# Altium project Additionneur.PrjPcb
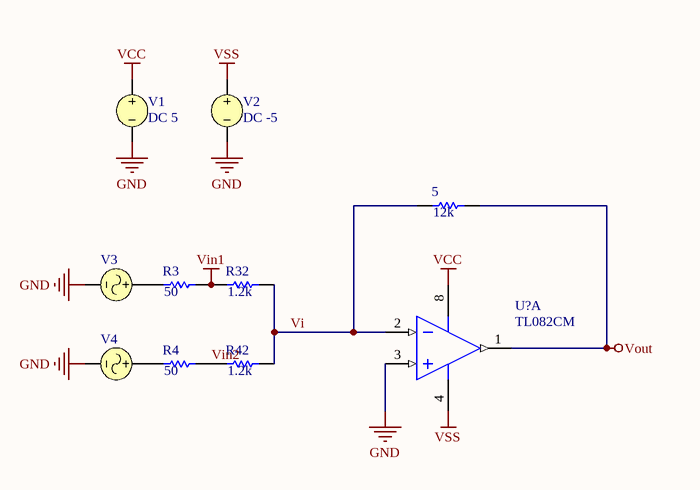
[diagram p0: additioneur.SchDoc]
1 sheet, 10 parts. Net scope: global (net labels, ports and power ports of the same name join across sheets).

## Sheet additioneur.SchDoc
size A4; SheetNumber: 1; SheetTotal: 1; SPICEModelCacheCUKPYHAH: <root> / <DocumentId>CUKPYHAH</DocumentId> / <CacheFrame Number="0"> / <Model Name="lf353" Kind="CKT"> / <Text>*////////////////////////////////////////////////////////// / *LF353 Wide Bandwidth Dual JFET-Input OP-AMP MACRO-MODEL / *////////////////////////////////////////////////////////// / * / * connections:    non-inverting input / *                 |   inverting input / *                 |   |   positive power supply / *                 |   |   |   negative power supply / *                 |   |   |   |   output / *                 |   |   |   |   | / *                 |   |   |   |   | / .SUBCKT LF353     1   2  99  50  28 / * / * PINOUT ORDER +IN -IN V+ V- OUT / * / * / *Features: / *Low supply current =                1.8mA / *Wide bandwidth =                     4MHz / *High slew rate =                   13V/uS / *Low offset voltage =                 10mV / * / *NOTE: Model is for single device only and simulated / *      supply current is 1/2 of total device current. / * / ****************INPUT STAGE************** / * / IOS 2 1 25P / *^Input offset current / R1 1 3 1E12 / R2 3 2 1E12 / I1 99 4 100U / J1 5 2 4 JX / J2 6 7 4 JX / R3 5 50 20K / R4 6 50 20K / *Fp2=12 MHz / C4 5 6 3.31573E-13 / * / ***********COMMON MODE EFFECT*********** / * / I2 99 50 1.7MA / *^Quiescent supply current / EOS 7 1 POLY(1) 16 49 5E-3 1 / *Input offset voltage.^ / R8 99 49 50K / R9 49 50 50K / * / *********OUTPUT VOLTAGE LIMITING******** / V2 99 8 2.13 / D1 9 8 DX / D2 10 9 DX / V3 10 50 2.13 / * / **************SECOND STAGE************** / * / EH 99 98 99 49 1 / F1 9 98 POLY(1) VA3 0 0 0 1.0985E7 / G1 98 9 5 6 1E-3 / R5 98 9 100MEG / VA3 9 11 0 / *Fp1=40.3 HZ / C3 98 11 39.493P / * / ***************POLE STAGE*************** / * / *Fp3=42 MHz / G3 98 15 9 49 1E-6 / R12 98 15 1MEG / C5 98 15 3.7894E-15 / * / *********COMMON-MODE ZERO STAGE********* / * / G4 98 16 3 49 1E-8 / L2 98 17 31.831M / R13 17 16 1K / * / **************OUTPUT STAGE************** / * / F6  99 50 VA7 1 / F5  99 23 VA8 1 / D5  21 23 DX / VA7 99 21 0 / D6  23 99 DX / E1  99 26 99 15 1 / VA8 26 27 0 / R16 27 28 35 / V5  28 25 0.1V / D4  25 15 DX / V4  24 28 0.1V / D3  15 24 DX / * / ***************MODELS USED************** / * / .MODEL DX D(IS=1E-15) / .MODEL JX PJF(BETA=1.25E-5 VTO=-2.00 IS=50E-12) / * / .ENDS</Text> / </Model> / </CacheFrame> / </root>

### Parts
5  value 12k  [AXIAL-0.3]  (hidden comment: Res1)
R3  value 50  [AXIAL-0.3]  (hidden comment: Res1)
R4  value 50  [AXIAL-0.3]  (hidden comment: Res1)
R32  value 1.2k  [AXIAL-0.3]  (hidden comment: Res1)
R42  value 1.2k  [AXIAL-0.3]  (hidden comment: Res1)
U?  TL082CM  [M08A_N]  (part A of 2)
V1  DC 5
V2  DC -5
V3  SIN(0 1 2k 0 0 0)  (value not drawn)
V4  SIN(0 1 1K 0 0 0)  (value not drawn)

### Nets
GND: U?.3(INA+) V1.2 V2.2 V3.2 V4.2
VCC: U?.8(V+) V1.1
Vin1: R3.2 R32.1
Vout: 5.2 U?.1(OUTA)
VSS: U?.4(V-) V2.1
Vi: 5.1 R32.2 R42.2 U?.2(INA-)
Vin2: R4.2 R42.1
NetR3_1: R3.1 V3.1
NetR4_1: R4.1 V4.1

### Library data of the parts
5 R3 R4 R32 R42 = Res1: Resistor; Published: 8-Jun-2000; LatestRevisionDate: 17-Jul-2002; LatestRevisionNote: Re-released for DXP Platform.; PackageReference: AXIAL-0.3; Publisher: Altium Limited; PackageDescription: Axial Device, Thru-Hole; 2 Leads; 0.3 in Pin Spacing
U? = TL082CM: Wide Bandwidth Dual JFET Input Operational Amplifier, 8-pin Narrow SOIC; Manufacturer: National Semiconductor; PackageTopMarking: NSZXTT*TL*082CM; PowerWise: N; CompType: Amplifiers; Published: 4-Dec-2008; LatestRevisionDate: 13-Jan-2009; LatestRevisionNote: Sim Model Added.; DatasheetVersion: Aug-2000; PackageVersion: revM, May-2009; PackageReference: M08A; Publisher: Altium Limited; PackageDescription: SOIC Narrow, 4.9 x 3.9 x 1.45mm, 8 Lead, 1.27mm Pitch; Supplier 1: Digi-Key; Supplier Part Number 1: TL082CM-ND; PartNumber: TL082CM; RoHS: N; PinCount: 8; Code_JEDEC: MS-012-AA; Code_IPC: SOIC127P600-8; ComponentLink1Description: TL082 Datasheet; ComponentLink1URL: http://www.national.com/ds/TL/TL082.pdf; ComponentLink2Description: TL082 Web Page; ComponentLink2URL: http://www.national.com/pf/TL/TL082.html; ComponentLink3Description: M08A Package Page; ComponentLink3URL: http://www.national.com/packaging/folders/m08a.html
V1 = VSRC: Voltage Source; Note: PCB Footprint - Not required; Value: 5; Published: 8-Jun-2000; LatestRevisionDate: 17-Jul-2002; LatestRevisionNote: Re-released for DXP Platform.; PackageReference: Not Applicable; Publisher: Altium Limited
V2 = VSRC: Voltage Source; Note: PCB Footprint - Not required; Published: 8-Jun-2000; LatestRevisionDate: 17-Jul-2002; LatestRevisionNote: Re-released for DXP Platform.; PackageReference: Not Applicable; Publisher: Altium Limited; Value: -5
V3 = VSIN: Sinusoidal Voltage Source; Note: PCB Footprint - Not required; Offset: 0; Amplitude: 1; AC Magnitude: 2; Published: 8-Jun-2000; LatestRevisionDate: 15-Nov-2004; LatestRevisionNote: Corrected Netlist.; PackageReference: Not Applicable; Publisher: Altium Limited; Frequency: 2k; Delay: 0; Damping Factor: 0; Phase: 0; DC Magnitude: 0; AC Phase: 0
V4 = VSIN: Sinusoidal Voltage Source; Note: PCB Footprint - Not required; Offset: 0; Amplitude: 1; Published: 8-Jun-2000; LatestRevisionDate: 15-Nov-2004; LatestRevisionNote: Corrected Netlist.; PackageReference: Not Applicable; Publisher: Altium Limited; Frequency: 1K; Delay: 0; Damping Factor: 0; Phase: 0; DC Magnitude: 0; AC Magnitude: 1; AC Phase: 0